# Altium schematic sheet light.SchDoc
size A4; SheetNumber: 3; SheetTotal: 4
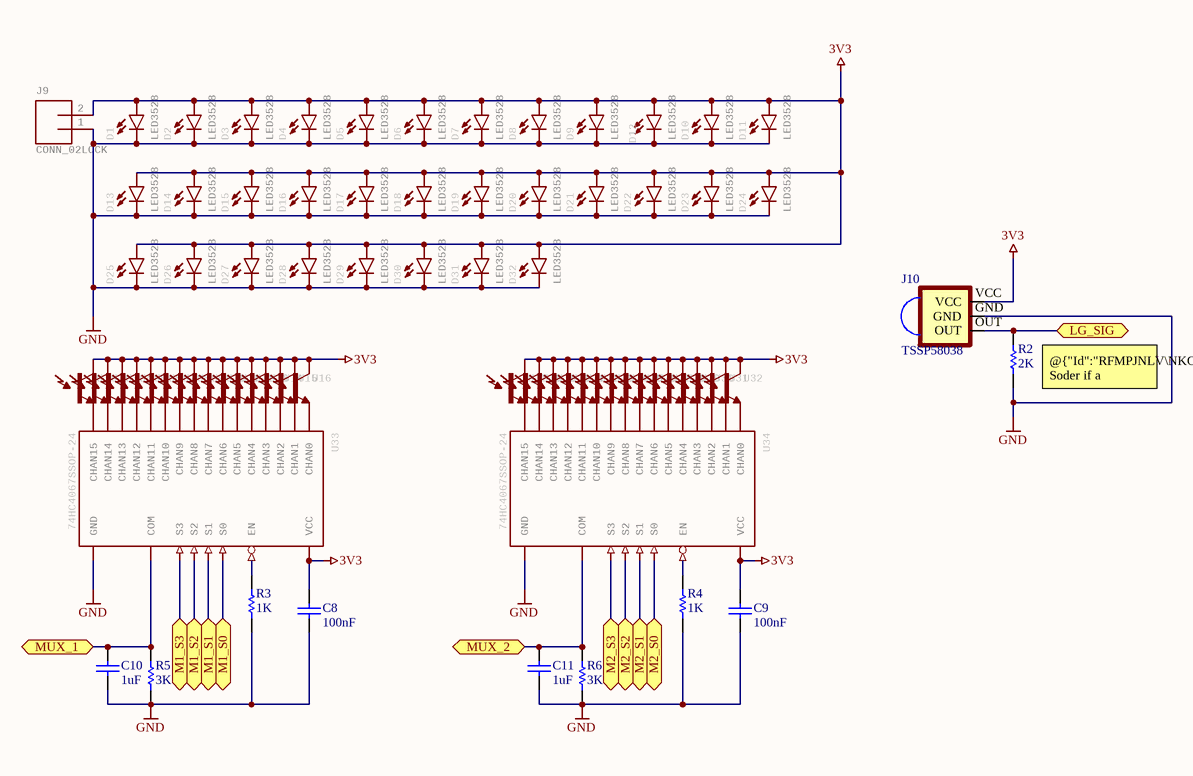
[diagram p0: light.SchDoc]

## Parts
C8  100nF  [CAPC1608X90X35ML10T15]
C9  100nF  [CAPC1608X90X35ML10T15]
C10  1uF  [CAPC1608X90X35ML10T15]
C11  1uF  [CAPC1608X90X35ML10T15]
D1  LED3528  [LED-3528]
D2  LED3528  [LED-3528]
D3  LED3528  [LED-3528]
D4  LED3528  [LED-3528]
D5  LED3528  [LED-3528]
D6  LED3528  [LED-3528]
D7  LED3528  [LED-3528]
D8  LED3528  [LED-3528]
D9  LED3528  [LED-3528]
D10  LED3528  [LED-3528]
D11  LED3528  [LED-3528]
D12  LED3528  [LED-3528]
D13  LED3528  [LED-3528]
D14  LED3528  [LED-3528]
D15  LED3528  [LED-3528]
D16  LED3528  [LED-3528]
D17  LED3528  [LED-3528]
D18  LED3528  [LED-3528]
D19  LED3528  [LED-3528]
D20  LED3528  [LED-3528]
D21  LED3528  [LED-3528]
D22  LED3528  [LED-3528]
D23  LED3528  [LED-3528]
D24  LED3528  [LED-3528]
D25  LED3528  [LED-3528]
D26  LED3528  [LED-3528]
D27  LED3528  [LED-3528]
D28  LED3528  [LED-3528]
D29  LED3528  [LED-3528]
D30  LED3528  [LED-3528]
D31  LED3528  [LED-3528]
D32  LED3528  [LED-3528]
J9  CONN_02LOCK  [1X02_LOCK]
J10  TSSP58038  [TSSP58038]
R2  2K  [RESISTOR0603]
R3  1K  [RESISTOR0603]
R4  1K  [RESISTOR0603]
R5  3K  [RESISTOR0603]
R6  3K  [RESISTOR0603]
U1  LIGHT_SENSOR_ALS  [ALS-PT19]  (value not drawn)
U2  LIGHT_SENSOR_ALS  [ALS-PT19]  (value not drawn)
U3  LIGHT_SENSOR_ALS  [ALS-PT19]  (value not drawn)
U4  LIGHT_SENSOR_ALS  [ALS-PT19]  (value not drawn)
U5  LIGHT_SENSOR_ALS  [ALS-PT19]  (value not drawn)
U6  LIGHT_SENSOR_ALS  [ALS-PT19]  (value not drawn)
U7  LIGHT_SENSOR_ALS  [ALS-PT19]  (value not drawn)
U8  LIGHT_SENSOR_ALS  [ALS-PT19]  (value not drawn)
U9  LIGHT_SENSOR_ALS  [ALS-PT19]  (value not drawn)
U10  LIGHT_SENSOR_ALS  [ALS-PT19]  (value not drawn)
U11  LIGHT_SENSOR_ALS  [ALS-PT19]  (value not drawn)
U12  LIGHT_SENSOR_ALS  [ALS-PT19]  (value not drawn)
U13  LIGHT_SENSOR_ALS  [ALS-PT19]  (value not drawn)
U14  LIGHT_SENSOR_ALS  [ALS-PT19]  (value not drawn)
U15  LIGHT_SENSOR_ALS  [ALS-PT19]  (value not drawn)
U16  LIGHT_SENSOR_ALS  [ALS-PT19]  (value not drawn)
U17  LIGHT_SENSOR_ALS  [ALS-PT19]  (value not drawn)
U18  LIGHT_SENSOR_ALS  [ALS-PT19]  (value not drawn)
U19  LIGHT_SENSOR_ALS  [ALS-PT19]  (value not drawn)
U20  LIGHT_SENSOR_ALS  [ALS-PT19]  (value not drawn)
U21  LIGHT_SENSOR_ALS  [ALS-PT19]  (value not drawn)
U22  LIGHT_SENSOR_ALS  [ALS-PT19]  (value not drawn)
U23  LIGHT_SENSOR_ALS  [ALS-PT19]  (value not drawn)
U24  LIGHT_SENSOR_ALS  [ALS-PT19]  (value not drawn)
U25  LIGHT_SENSOR_ALS  [ALS-PT19]  (value not drawn)
U26  LIGHT_SENSOR_ALS  [ALS-PT19]  (value not drawn)
U27  LIGHT_SENSOR_ALS  [ALS-PT19]  (value not drawn)
U28  LIGHT_SENSOR_ALS  [ALS-PT19]  (value not drawn)
U29  LIGHT_SENSOR_ALS  [ALS-PT19]  (value not drawn)
U30  LIGHT_SENSOR_ALS  [ALS-PT19]  (value not drawn)
U31  LIGHT_SENSOR_ALS  [ALS-PT19]  (value not drawn)
U32  LIGHT_SENSOR_ALS  [ALS-PT19]  (value not drawn)
U33  74HC4067SSOP-24  [SSOP24]
U34  74HC4067SSOP-24  [SSOP24]

## Ports
LG_SIG (bidir), M1_S0 (bidir), M1_S1 (bidir), M1_S2 (bidir), M1_S3 (bidir), M2_S0 (bidir), M2_S1 (bidir), M2_S2 (bidir), M2_S3 (bidir), MUX_1 (bidir), MUX_2 (bidir)

## Nets
3V3: C8.2 C9.2 D1.1(A) D2.1(A) D3.1(A) D4.1(A) D5.1(A) D6.1(A) D7.1(A) D8.1(A) D9.1(A) D10.1(A) D11.1(A) D12.1(A) D13.1(A) D14.1(A) D15.1(A) D16.1(A) D17.1(A) D18.1(A) D19.1(A) D20.1(A) D21.1(A) D22.1(A) D23.1(A) D24.1(A) D25.1(A) D26.1(A) D27.1(A) D28.1(A) D29.1(A) D30.1(A) D31.1(A) D32.1(A) J9.2 J10.VCC U1.1(C1) U2.1(C1) U3.1(C1) U4.1(C1) U5.1(C1) U6.1(C1) U7.1(C1) U8.1(C1) U9.1(C1) U10.1(C1) U11.1(C1) U12.1(C1) U13.1(C1) U14.1(C1) U15.1(C1) U16.1(C1) U17.1(C1) U18.1(C1) U19.1(C1) U20.1(C1) U21.1(C1) U22.1(C1) U23.1(C1) U24.1(C1) U25.1(C1) U26.1(C1) U27.1(C1) U28.1(C1) U29.1(C1) U30.1(C1) U31.1(C1) U32.1(C1) U33.24(VCC) U34.24(VCC)
GND: C8.1 C9.1 C10.1 C11.1 D1.2(C) D2.2(C) D3.2(C) D4.2(C) D5.2(C) D6.2(C) D7.2(C) D8.2(C) D9.2(C) D10.2(C) D11.2(C) D12.2(C) D13.2(C) D14.2(C) D15.2(C) D16.2(C) D17.2(C) D18.2(C) D19.2(C) D20.2(C) D21.2(C) D22.2(C) D23.2(C) D24.2(C) D25.2(C) D26.2(C) D27.2(C) D28.2(C) D29.2(C) D30.2(C) D31.2(C) D32.2(C) J9.1 J10.GND R2.1 R3.1 R4.1 R5.1 R6.1 U33.12(GND) U34.12(GND)
LG_SIG: J10.OUT R2.2 ; port LG_SIG
M1_S0: U33.10(S0) ; port M1_S0
M1_S1: U33.11(S1) ; port M1_S1
M1_S2: U33.14(S2) ; port M1_S2
M1_S3: U33.13(S3) ; port M1_S3
M2_S0: U34.10(S0) ; port M2_S0
M2_S1: U34.11(S1) ; port M2_S1
M2_S2: U34.14(S2) ; port M2_S2
M2_S3: U34.13(S3) ; port M2_S3
MUX_1: C10.2 R5.2 U33.1(COM) ; port MUX_1
MUX_2: C11.2 R6.2 U34.1(COM) ; port MUX_2
NetR3_2: R3.2 U33.15(EN)
NetR4_2: R4.2 U34.15(EN)
NetU1_2: U1.2(E1) U33.16(CHAN15)
NetU2_2: U2.2(E1) U33.17(CHAN14)
NetU3_2: U3.2(E1) U33.18(CHAN13)
NetU4_2: U4.2(E1) U33.19(CHAN12)
NetU5_2: U5.2(E1) U33.20(CHAN11)
NetU6_2: U6.2(E1) U33.21(CHAN10)
NetU7_2: U7.2(E1) U33.22(CHAN9)
NetU8_2: U8.2(E1) U33.23(CHAN8)
NetU9_2: U9.2(E1) U33.2(CHAN7)
NetU10_2: U10.2(E1) U33.3(CHAN6)
NetU11_2: U11.2(E1) U33.4(CHAN5)
NetU12_2: U12.2(E1) U33.5(CHAN4)
NetU13_2: U13.2(E1) U33.6(CHAN3)
NetU14_2: U14.2(E1) U33.7(CHAN2)
NetU15_2: U15.2(E1) U33.8(CHAN1)
NetU16_2: U16.2(E1) U33.9(CHAN0)
NetU17_2: U17.2(E1) U34.16(CHAN15)
NetU18_2: U18.2(E1) U34.17(CHAN14)
NetU19_2: U19.2(E1) U34.18(CHAN13)
NetU20_2: U20.2(E1) U34.19(CHAN12)
NetU21_2: U21.2(E1) U34.20(CHAN11)
NetU22_2: U22.2(E1) U34.21(CHAN10)
NetU23_2: U23.2(E1) U34.22(CHAN9)
NetU24_2: U24.2(E1) U34.23(CHAN8)
NetU25_2: U25.2(E1) U34.2(CHAN7)
NetU26_2: U26.2(E1) U34.3(CHAN6)
NetU27_2: U27.2(E1) U34.4(CHAN5)
NetU28_2: U28.2(E1) U34.5(CHAN4)
NetU29_2: U29.2(E1) U34.6(CHAN3)
NetU30_2: U30.2(E1) U34.7(CHAN2)
NetU31_2: U31.2(E1) U34.8(CHAN1)
NetU32_2: U32.2(E1) U34.9(CHAN0)

## Notes on the sheet
- (near R2) @{"Id":"RFMPJNLV\NKOGRTDX"} Soder if a photoresis is used

## Library data of the parts
C8 C9 = CMP-001-00005-1: CAP 100nF; Value: 100nF
C10 C11 = CMP-001-00001-5: CAP 1uF; Value: 1uF
D1-D32 = CMP-066-000002-5: 3528-LED; SymbolName_1: LED-1; DeviceName: 3528; GateName_1: G$1; DeviceSetName: LED; Component Type: Standard; LibraryName: JH; Package: LED-3528; Pin Count: 2; Design Item ID: LED3528; Source: JH.SCHLIB
J9 = CMP-027-000000-1: GateName_1: G$1; DeviceName: LOCK; LibraryName: SparkFun-Connectors; Source: SparkFun-Connectors.SCHLIB; Pin Count: 2; Component Type: Standard; Design Item ID: CONN_02LOCK; DeviceSetName: CONN_02; SymbolName_1: CONN_02; Package: 1X02_LOCK
J10 = CMP-073-000000-6: 38 kHz 25 m 45° 5.5 V Through Hole IR Receiver Module for Light Barrier Systems; MF: Vishay; MP: TSSP58038; Value: *; Pin Count: 3; Component Type: Standard; Package: TSSP; Design Item ID: TSSP58038
R2 = CMP-009-00008-1: RES 2K 0603; Value: 2K
R3 R4 = CMP-009-00001-12: RES 1K 0603; Value: 1K
R5 R6 = CMP-009-00007-1: RES 3K 0603; Value: 3K
U1-U32 = CMP-071-000008-4: Photo Resistor; DeviceName: _ALS; SymbolName_1: LIGHTSENSOR; GateName_1: G$1; LibraryName: JH; Pin Count: 2; DeviceSetName: LIGHT_SENSOR; Component Type: Standard; Package: ALS-PT19; Design Item ID: LIGHT_SENSOR_ALS; Source: JH.SCHLIB
U33 U34 = CMP-071-000007-3: 16 Channel Analog MUX; GateName_1: G$1; Source: JH.SCHLIB; DeviceSetName: 74HC4067; Pin Count: 24; LibraryName: JH; Package: SSOP24; SymbolName_1: 74HC4067; Component Type: Standard; DeviceName: SSOP-24; Design Item ID: 74HC4067SSOP-24